# EAGLE design Connector (EAGLE 6.5.0)
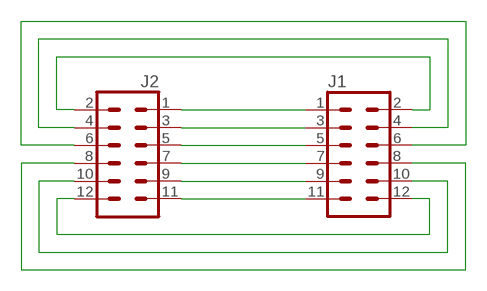
[diagram p0: schematic, sheet 1]

## Parts
J1  IDC-SOCKET06X2  [SOCKET06X2]
J2  CON06X2-2MM  [CON06X2_2MM]

## Nets
N$1: J1.1 J2.1
N$2: J1.3 J2.3
N$3: J1.5 J2.5
N$4: J1.7 J2.7
N$5: J1.9 J2.9
N$6: J1.11 J2.11
N$7: J1.2 J2.2
N$8: J1.4 J2.4
N$9: J1.6 J2.6
N$10: J1.12 J2.12
N$11: J1.10 J2.10
N$12: J1.8 J2.8

## Library data of the parts
J1 = Connectors:IDC-SOCKET06X2
J2 = Connectors:CON06X2-2MM

## Board
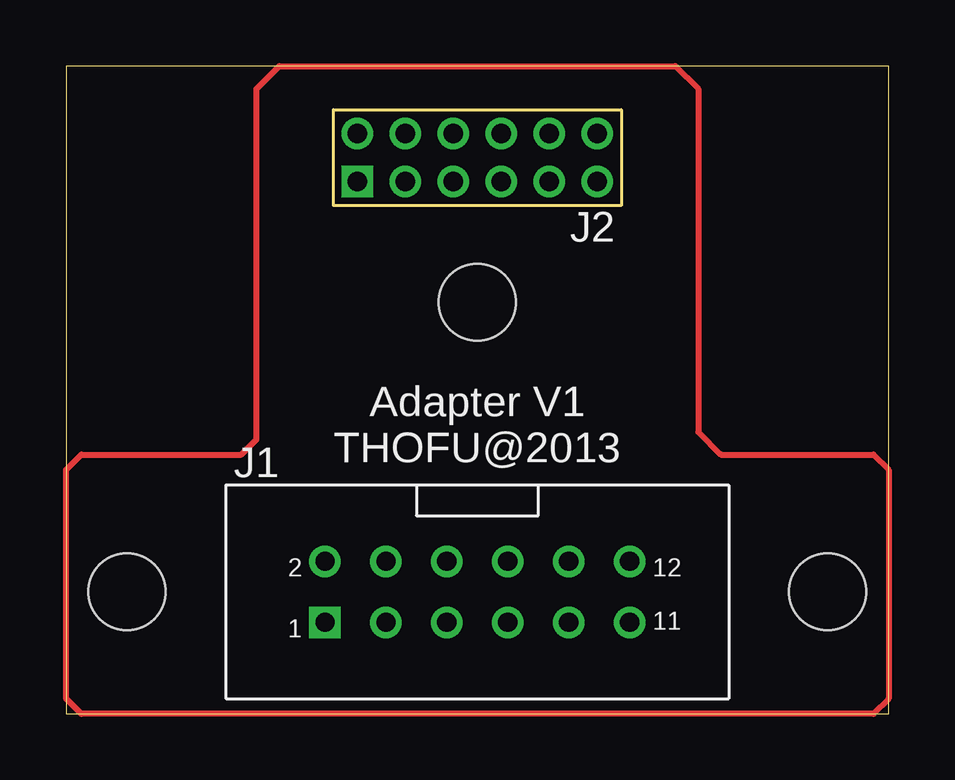
[diagram p1: board, top side]
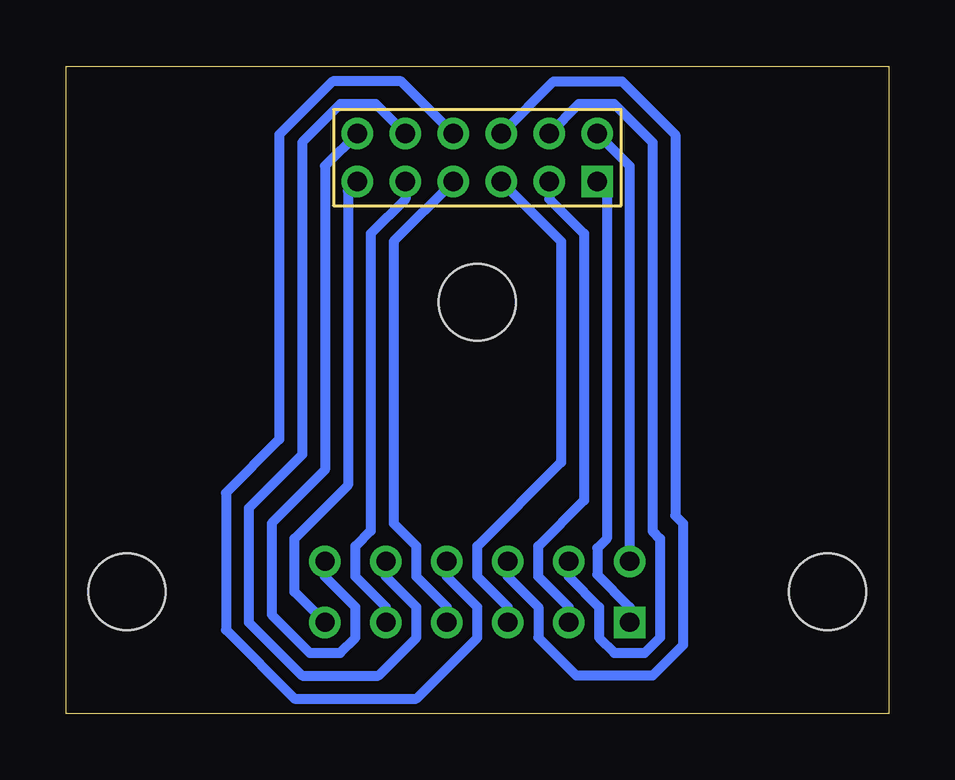
[diagram p2: board, bottom side, seen from below]

Size 34.29 x 26.99 mm. Coordinates in mm from the lower left corner, seen from the top.
Outline: 0,0 34.29,0 34.29,26.99 0,26.99 0,0
Copper layers (1*16): Top 0.035mm / dielectric 1.5mm / Bottom 0.035mm
Design rules "default": minimum track width 10mil, minimum drill 24mil, track to track 8mil, track to pad 8mil, pad to pad 8mil, via to via 8mil, smd to smd 8mil, copper to edge 40mil, drill to drill 8mil, minimum pad ring 10mil, minimum via ring 8mil, stop-mask expansion 4mil, vias tented up to drill 0mil, thermal gap 10mil
Holes 3.2 mm at 2.54,5.08 31.75,5.08 17.14,17.14

### Footprints (pad centres in the part's own frame; a part is rotated, then mirrored left to right if it is on the bottom)
SOCKET06X2 = drill 0.8 square: 1 -6.35,-1.27 | drill 0.8: 2 -6.35,1.27; 3 -3.81,-1.27; 4 -3.81,1.27; 5 -1.27,-1.27; 6 -1.27,1.27; 7 1.27,-1.27; 8 1.27,1.27; 9 3.81,-1.27; 10 3.81,1.27; 11 6.35,-1.27; 12 6.35,1.27
CON06X2_2MM = drill 0.8 square: 1 -5,-1 | drill 0.8: 2 -5,1; 3 -3,-1; 4 -3,1; 5 -1,-1; 6 -1,1; 7 1,-1; 8 1,1; 9 3,-1; 10 3,1; 11 5,-1; 12 5,1

### Placement (x,y rotation side)
J1  17.14,5.08 0 top
J2  17.14,23.18 0 top

### Tracks (layer width: path | path; a pad name or v marks a point on that pad's centre or on a via)
N$1
  Bottom 0.406: J1.1 10.79,4.44 12.14,5.8 12.14,6.91 11.75,7.3 11.75,21.78 J2.1
N$2
  Bottom 0.406: J1.3 13.34,4.44 14.61,5.71 14.61,6.99 12.7,8.89 12.7,20 14.14,21.45 J2.3
N$3
  Bottom 0.406: J1.5 15.88,4.44 17.14,5.71 17.14,6.99 13.65,10.48 13.65,19.69 J2.5
N$4
  Bottom 0.406: J1.7 18.41,4.44 19.68,5.71 19.68,6.99 20.64,7.94 20.64,19.69 J2.7
N$5
  Bottom 0.406: J1.9 20.95,4.44 22.23,5.71 22.23,6.99 21.59,7.62 21.59,20 20.14,21.45 J2.9
N$6
  Bottom 0.406: J1.11 24.77,5.08 24.77,7.3 22.54,9.53 22.54,21.78 J2.11
N$7
  Bottom 0.406: J2.2 10.79,22.83 J1.2
N$8
  Bottom 0.406: J1.4 13.34,5.71 12.06,4.44 12.06,3.18 11.43,2.54 10.16,2.54 9.53,3.18 9.53,7.3 9.84,7.62 9.84,23.81 11.43,25.4 12.92,25.4 J2.4
N$9
  Bottom 0.406: J1.6 15.88,5.71 14.61,4.44 14.61,3.18 13.02,1.59 9.84,1.59 8.57,2.86 8.57,7.94 8.89,8.25 8.89,24.13 11.11,26.35 13.97,26.35 J2.6
N$10
  Bottom 0.406: J2.12 23.5,22.83 23.5,10.16 25.72,7.94 25.72,4.13 24.13,2.54 22.86,2.54 22.23,3.18 22.23,4.44 23.5,5.71 J1.12
N$11
  Bottom 0.406: J2.10 21.37,25.4 22.86,25.4 24.45,23.81 24.45,10.8 26.67,8.57 26.67,3.81 24.45,1.59 21.27,1.59 19.68,3.18 19.68,4.44 20.95,5.71 J1.10
N$12
  Bottom 0.406: J2.8 20.32,26.35 23.18,26.35 25.4,24.13 25.4,11.43 27.62,9.21 27.62,3.49 24.77,0.63 19.68,0.63 17.14,3.18 17.14,4.44 18.41,5.71 J1.8
N$14
  Top 0.254: 0.64,0 0,0.63 0,10.16 0.64,10.8 7.3,10.8 7.94,11.43 7.94,26.03 8.89,26.99 25.4,26.99 26.35,26.03 26.35,11.75 27.3,10.8 33.66,10.8 34.29,10.16 34.29,0.63 33.66,0 0.64,0

### Text on the board
tNames: Adapter V1 / THOFU@2013